# EasyEDA schematic output_schematic_Z.json
TITLE: Sheet_1; REV: 1.0; Date: 2025-10-31; Sheet: 1/1; Drawn By: robdobsn; Company: Your Company
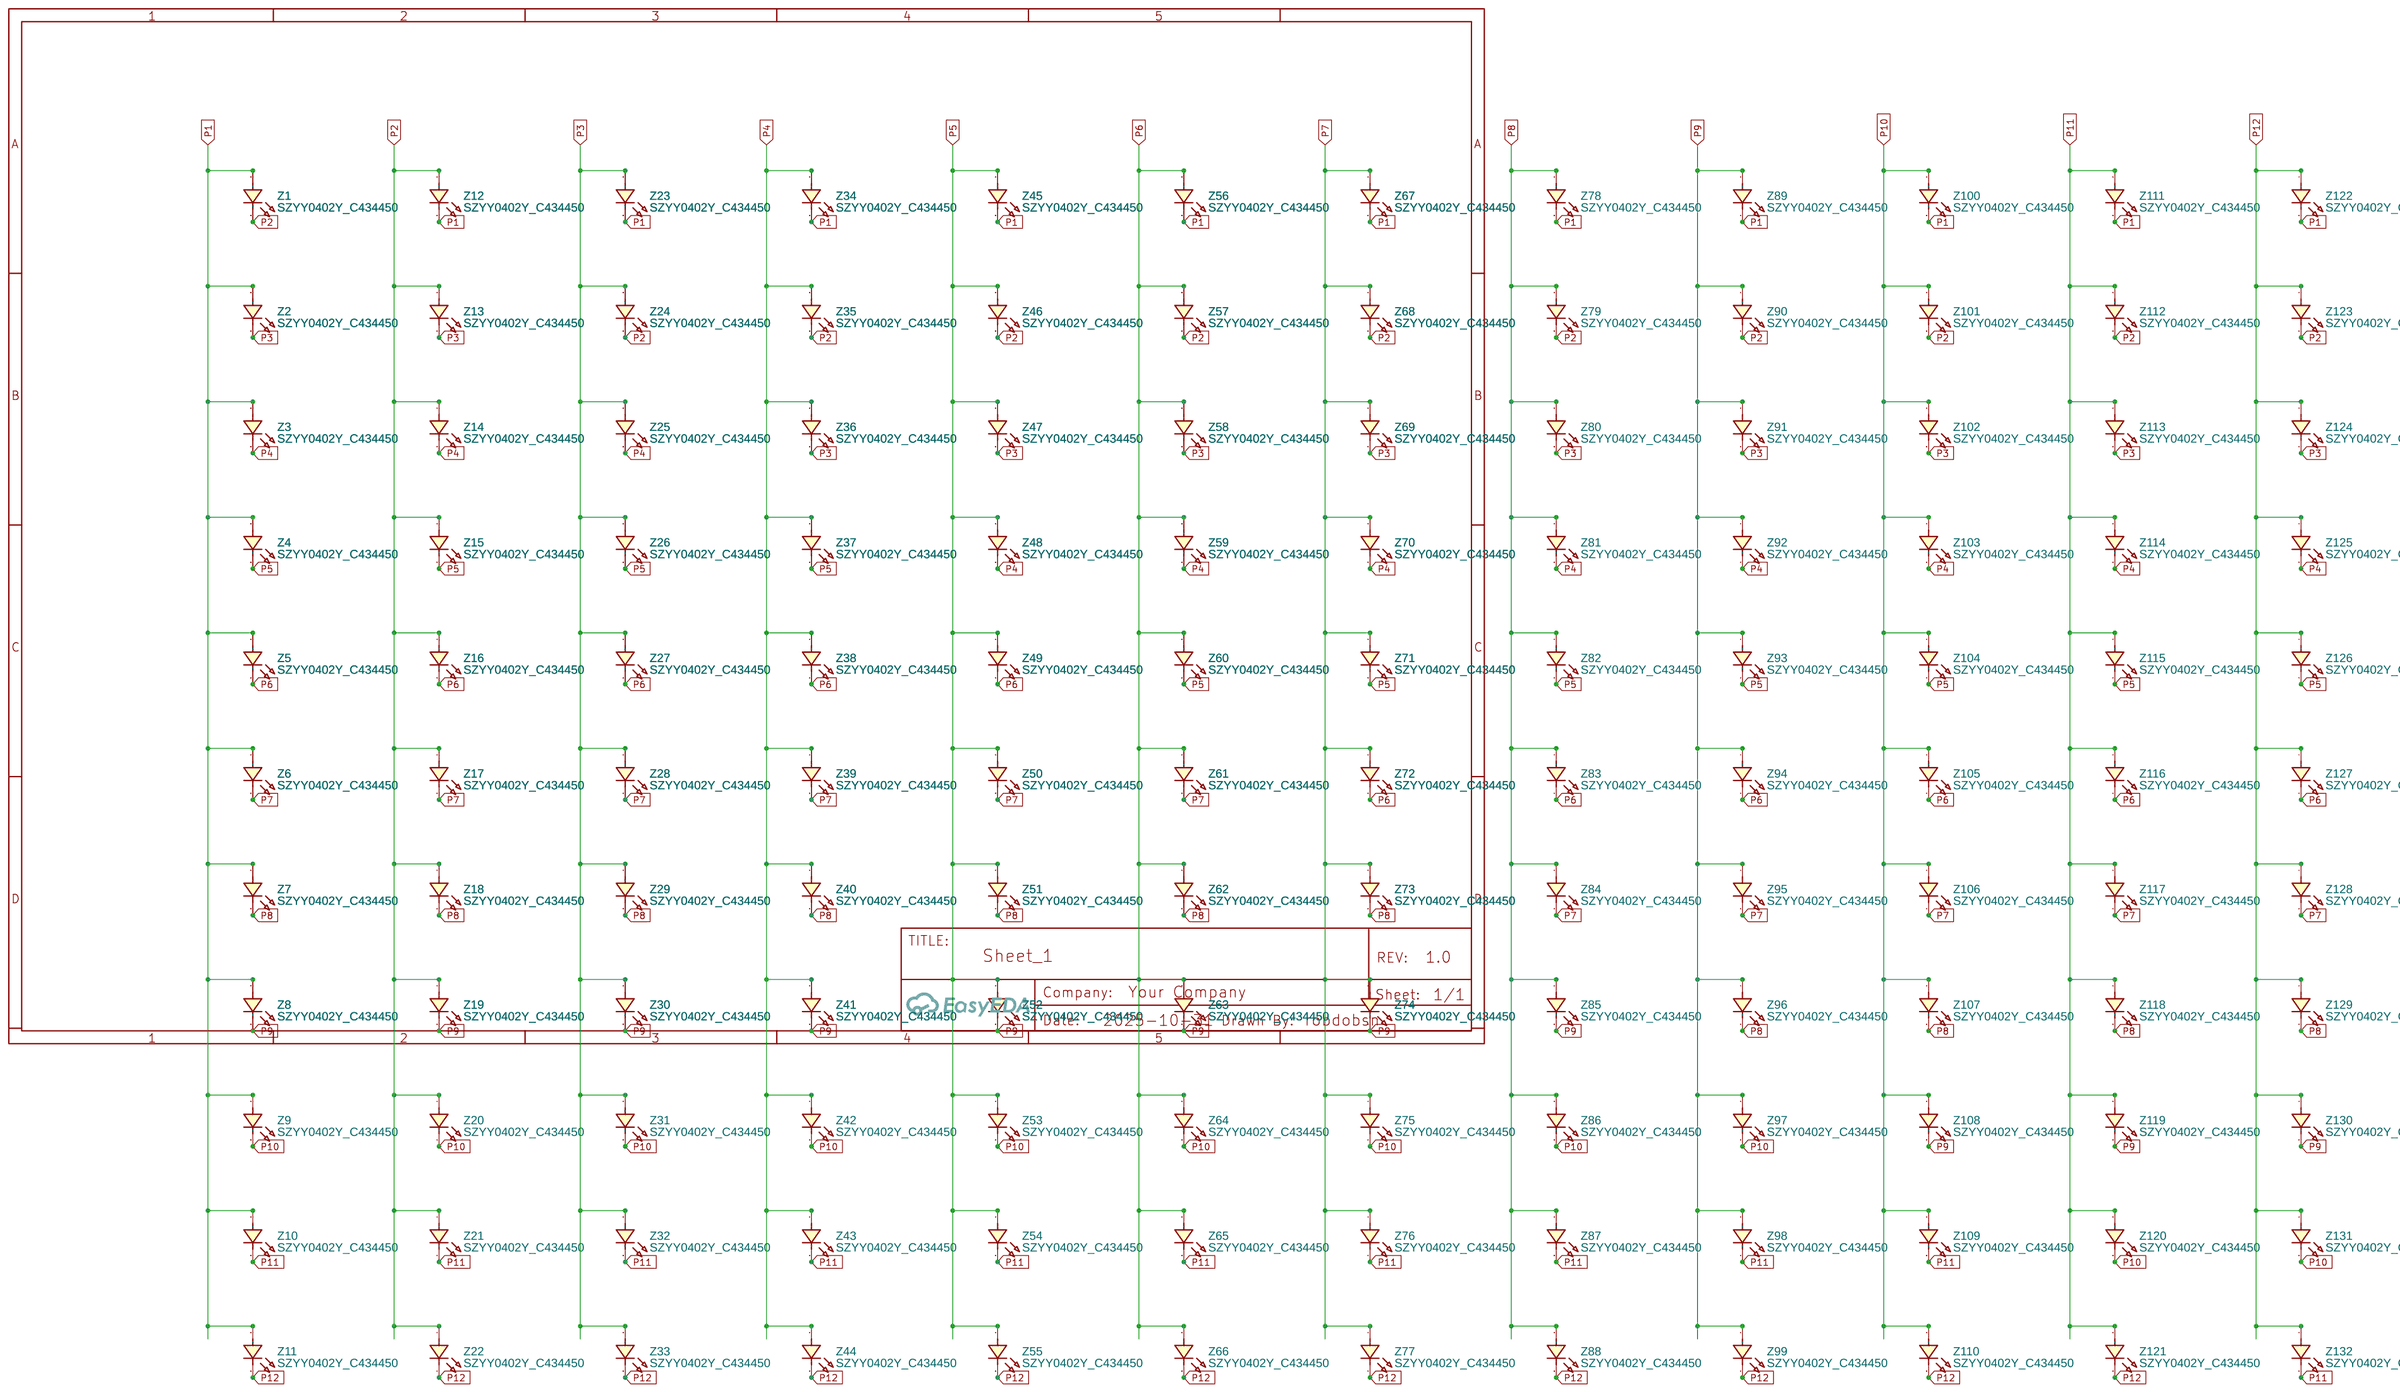
[diagram p0: schematic sheet]

## Parts
Z1  SZYY0402Y_C434450  [LED0402-FD_YELLOW]
Z2  SZYY0402Y_C434450  [LED0402-FD_YELLOW]
Z3  SZYY0402Y_C434450  [LED0402-FD_YELLOW]
Z4  SZYY0402Y_C434450  [LED0402-FD_YELLOW]
Z5  SZYY0402Y_C434450  [LED0402-FD_YELLOW]
Z6  SZYY0402Y_C434450  [LED0402-FD_YELLOW]
Z7  SZYY0402Y_C434450  [LED0402-FD_YELLOW]
Z8  SZYY0402Y_C434450  [LED0402-FD_YELLOW]
Z9  SZYY0402Y_C434450  [LED0402-FD_YELLOW]
Z10  SZYY0402Y_C434450  [LED0402-FD_YELLOW]
Z11  SZYY0402Y_C434450  [LED0402-FD_YELLOW]
Z12  SZYY0402Y_C434450  [LED0402-FD_YELLOW]
Z13  SZYY0402Y_C434450  [LED0402-FD_YELLOW]
Z14  SZYY0402Y_C434450  [LED0402-FD_YELLOW]
Z15  SZYY0402Y_C434450  [LED0402-FD_YELLOW]
Z16  SZYY0402Y_C434450  [LED0402-FD_YELLOW]
Z17  SZYY0402Y_C434450  [LED0402-FD_YELLOW]
Z18  SZYY0402Y_C434450  [LED0402-FD_YELLOW]
Z19  SZYY0402Y_C434450  [LED0402-FD_YELLOW]
Z20  SZYY0402Y_C434450  [LED0402-FD_YELLOW]
Z21  SZYY0402Y_C434450  [LED0402-FD_YELLOW]
Z22  SZYY0402Y_C434450  [LED0402-FD_YELLOW]
Z23  SZYY0402Y_C434450  [LED0402-FD_YELLOW]
Z24  SZYY0402Y_C434450  [LED0402-FD_YELLOW]
Z25  SZYY0402Y_C434450  [LED0402-FD_YELLOW]
Z26  SZYY0402Y_C434450  [LED0402-FD_YELLOW]
Z27  SZYY0402Y_C434450  [LED0402-FD_YELLOW]
Z28  SZYY0402Y_C434450  [LED0402-FD_YELLOW]
Z29  SZYY0402Y_C434450  [LED0402-FD_YELLOW]
Z30  SZYY0402Y_C434450  [LED0402-FD_YELLOW]
Z31  SZYY0402Y_C434450  [LED0402-FD_YELLOW]
Z32  SZYY0402Y_C434450  [LED0402-FD_YELLOW]
Z33  SZYY0402Y_C434450  [LED0402-FD_YELLOW]
Z34  SZYY0402Y_C434450  [LED0402-FD_YELLOW]
Z35  SZYY0402Y_C434450  [LED0402-FD_YELLOW]
Z36  SZYY0402Y_C434450  [LED0402-FD_YELLOW]
Z37  SZYY0402Y_C434450  [LED0402-FD_YELLOW]
Z38  SZYY0402Y_C434450  [LED0402-FD_YELLOW]
Z39  SZYY0402Y_C434450  [LED0402-FD_YELLOW]
Z40  SZYY0402Y_C434450  [LED0402-FD_YELLOW]
Z41  SZYY0402Y_C434450  [LED0402-FD_YELLOW]
Z42  SZYY0402Y_C434450  [LED0402-FD_YELLOW]
Z43  SZYY0402Y_C434450  [LED0402-FD_YELLOW]
Z44  SZYY0402Y_C434450  [LED0402-FD_YELLOW]
Z45  SZYY0402Y_C434450  [LED0402-FD_YELLOW]
Z46  SZYY0402Y_C434450  [LED0402-FD_YELLOW]
Z47  SZYY0402Y_C434450  [LED0402-FD_YELLOW]
Z48  SZYY0402Y_C434450  [LED0402-FD_YELLOW]
Z49  SZYY0402Y_C434450  [LED0402-FD_YELLOW]
Z50  SZYY0402Y_C434450  [LED0402-FD_YELLOW]
Z51  SZYY0402Y_C434450  [LED0402-FD_YELLOW]
Z52  SZYY0402Y_C434450  [LED0402-FD_YELLOW]
Z53  SZYY0402Y_C434450  [LED0402-FD_YELLOW]
Z54  SZYY0402Y_C434450  [LED0402-FD_YELLOW]
Z55  SZYY0402Y_C434450  [LED0402-FD_YELLOW]
Z56  SZYY0402Y_C434450  [LED0402-FD_YELLOW]
Z57  SZYY0402Y_C434450  [LED0402-FD_YELLOW]
Z58  SZYY0402Y_C434450  [LED0402-FD_YELLOW]
Z59  SZYY0402Y_C434450  [LED0402-FD_YELLOW]
Z60  SZYY0402Y_C434450  [LED0402-FD_YELLOW]
Z61  SZYY0402Y_C434450  [LED0402-FD_YELLOW]
Z62  SZYY0402Y_C434450  [LED0402-FD_YELLOW]
Z63  SZYY0402Y_C434450  [LED0402-FD_YELLOW]
Z64  SZYY0402Y_C434450  [LED0402-FD_YELLOW]
Z65  SZYY0402Y_C434450  [LED0402-FD_YELLOW]
Z66  SZYY0402Y_C434450  [LED0402-FD_YELLOW]
Z67  SZYY0402Y_C434450  [LED0402-FD_YELLOW]
Z68  SZYY0402Y_C434450  [LED0402-FD_YELLOW]
Z69  SZYY0402Y_C434450  [LED0402-FD_YELLOW]
Z70  SZYY0402Y_C434450  [LED0402-FD_YELLOW]
Z71  SZYY0402Y_C434450  [LED0402-FD_YELLOW]
Z72  SZYY0402Y_C434450  [LED0402-FD_YELLOW]
Z73  SZYY0402Y_C434450  [LED0402-FD_YELLOW]
Z74  SZYY0402Y_C434450  [LED0402-FD_YELLOW]
Z75  SZYY0402Y_C434450  [LED0402-FD_YELLOW]
Z76  SZYY0402Y_C434450  [LED0402-FD_YELLOW]
Z77  SZYY0402Y_C434450  [LED0402-FD_YELLOW]
Z78  SZYY0402Y_C434450  [LED0402-FD_YELLOW]
Z79  SZYY0402Y_C434450  [LED0402-FD_YELLOW]
Z80  SZYY0402Y_C434450  [LED0402-FD_YELLOW]
Z81  SZYY0402Y_C434450  [LED0402-FD_YELLOW]
Z82  SZYY0402Y_C434450  [LED0402-FD_YELLOW]
Z83  SZYY0402Y_C434450  [LED0402-FD_YELLOW]
Z84  SZYY0402Y_C434450  [LED0402-FD_YELLOW]
Z85  SZYY0402Y_C434450  [LED0402-FD_YELLOW]
Z86  SZYY0402Y_C434450  [LED0402-FD_YELLOW]
Z87  SZYY0402Y_C434450  [LED0402-FD_YELLOW]
Z88  SZYY0402Y_C434450  [LED0402-FD_YELLOW]
Z89  SZYY0402Y_C434450  [LED0402-FD_YELLOW]
Z90  SZYY0402Y_C434450  [LED0402-FD_YELLOW]
Z91  SZYY0402Y_C434450  [LED0402-FD_YELLOW]
Z92  SZYY0402Y_C434450  [LED0402-FD_YELLOW]
Z93  SZYY0402Y_C434450  [LED0402-FD_YELLOW]
Z94  SZYY0402Y_C434450  [LED0402-FD_YELLOW]
Z95  SZYY0402Y_C434450  [LED0402-FD_YELLOW]
Z96  SZYY0402Y_C434450  [LED0402-FD_YELLOW]
Z97  SZYY0402Y_C434450  [LED0402-FD_YELLOW]
Z98  SZYY0402Y_C434450  [LED0402-FD_YELLOW]
Z99  SZYY0402Y_C434450  [LED0402-FD_YELLOW]
Z100  SZYY0402Y_C434450  [LED0402-FD_YELLOW]
Z101  SZYY0402Y_C434450  [LED0402-FD_YELLOW]
Z102  SZYY0402Y_C434450  [LED0402-FD_YELLOW]
Z103  SZYY0402Y_C434450  [LED0402-FD_YELLOW]
Z104  SZYY0402Y_C434450  [LED0402-FD_YELLOW]
Z105  SZYY0402Y_C434450  [LED0402-FD_YELLOW]
Z106  SZYY0402Y_C434450  [LED0402-FD_YELLOW]
Z107  SZYY0402Y_C434450  [LED0402-FD_YELLOW]
Z108  SZYY0402Y_C434450  [LED0402-FD_YELLOW]
Z109  SZYY0402Y_C434450  [LED0402-FD_YELLOW]
Z110  SZYY0402Y_C434450  [LED0402-FD_YELLOW]
Z111  SZYY0402Y_C434450  [LED0402-FD_YELLOW]
Z112  SZYY0402Y_C434450  [LED0402-FD_YELLOW]
Z113  SZYY0402Y_C434450  [LED0402-FD_YELLOW]
Z114  SZYY0402Y_C434450  [LED0402-FD_YELLOW]
Z115  SZYY0402Y_C434450  [LED0402-FD_YELLOW]
Z116  SZYY0402Y_C434450  [LED0402-FD_YELLOW]
Z117  SZYY0402Y_C434450  [LED0402-FD_YELLOW]
Z118  SZYY0402Y_C434450  [LED0402-FD_YELLOW]
Z119  SZYY0402Y_C434450  [LED0402-FD_YELLOW]
Z120  SZYY0402Y_C434450  [LED0402-FD_YELLOW]
Z121  SZYY0402Y_C434450  [LED0402-FD_YELLOW]
Z122  SZYY0402Y_C434450  [LED0402-FD_YELLOW]
Z123  SZYY0402Y_C434450  [LED0402-FD_YELLOW]
Z124  SZYY0402Y_C434450  [LED0402-FD_YELLOW]
Z125  SZYY0402Y_C434450  [LED0402-FD_YELLOW]
Z126  SZYY0402Y_C434450  [LED0402-FD_YELLOW]
Z127  SZYY0402Y_C434450  [LED0402-FD_YELLOW]
Z128  SZYY0402Y_C434450  [LED0402-FD_YELLOW]
Z129  SZYY0402Y_C434450  [LED0402-FD_YELLOW]
Z130  SZYY0402Y_C434450  [LED0402-FD_YELLOW]
Z131  SZYY0402Y_C434450  [LED0402-FD_YELLOW]
Z132  SZYY0402Y_C434450  [LED0402-FD_YELLOW]

## Library data of the parts
Z1-Z132 = SZYY0402Y_C434450: Contributor: lcsc; Supplier: LCSC; Supplier Part: C434450; Manufacturer: yongyu(永裕光电); Manufacturer Part: SZYY0402Y; JLCPCB Part Class: Extended Part

## Nets
P1: Z1.1(A) Z2.1(A) Z3.1(A) Z4.1(A) Z5.1(A) Z6.1(A) Z7.1(A) Z8.1(A) Z9.1(A) Z10.1(A) Z11.1(A) Z12.2(K) Z23.2(K) Z34.2(K) Z45.2(K) Z56.2(K) Z67.2(K) Z78.2(K) Z89.2(K) Z100.2(K) Z111.2(K) Z122.2(K)
P2: Z1.2(K) Z12.1(A) Z13.1(A) Z14.1(A) Z15.1(A) Z16.1(A) Z17.1(A) Z18.1(A) Z19.1(A) Z20.1(A) Z21.1(A) Z22.1(A) Z24.2(K) Z35.2(K) Z46.2(K) Z57.2(K) Z68.2(K) Z79.2(K) Z90.2(K) Z101.2(K) Z112.2(K) Z123.2(K)
P3: Z2.2(K) Z13.2(K) Z23.1(A) Z24.1(A) Z25.1(A) Z26.1(A) Z27.1(A) Z28.1(A) Z29.1(A) Z30.1(A) Z31.1(A) Z32.1(A) Z33.1(A) Z36.2(K) Z47.2(K) Z58.2(K) Z69.2(K) Z80.2(K) Z91.2(K) Z102.2(K) Z113.2(K) Z124.2(K)
P4: Z3.2(K) Z14.2(K) Z25.2(K) Z34.1(A) Z35.1(A) Z36.1(A) Z37.1(A) Z38.1(A) Z39.1(A) Z40.1(A) Z41.1(A) Z42.1(A) Z43.1(A) Z44.1(A) Z48.2(K) Z59.2(K) Z70.2(K) Z81.2(K) Z92.2(K) Z103.2(K) Z114.2(K) Z125.2(K)
P5: Z4.2(K) Z15.2(K) Z26.2(K) Z37.2(K) Z45.1(A) Z46.1(A) Z47.1(A) Z48.1(A) Z49.1(A) Z50.1(A) Z51.1(A) Z52.1(A) Z53.1(A) Z54.1(A) Z55.1(A) Z60.2(K) Z71.2(K) Z82.2(K) Z93.2(K) Z104.2(K) Z115.2(K) Z126.2(K)
P6: Z5.2(K) Z16.2(K) Z27.2(K) Z38.2(K) Z49.2(K) Z56.1(A) Z57.1(A) Z58.1(A) Z59.1(A) Z60.1(A) Z61.1(A) Z62.1(A) Z63.1(A) Z64.1(A) Z65.1(A) Z66.1(A) Z72.2(K) Z83.2(K) Z94.2(K) Z105.2(K) Z116.2(K) Z127.2(K)
P7: Z6.2(K) Z17.2(K) Z28.2(K) Z39.2(K) Z50.2(K) Z61.2(K) Z67.1(A) Z68.1(A) Z69.1(A) Z70.1(A) Z71.1(A) Z72.1(A) Z73.1(A) Z74.1(A) Z75.1(A) Z76.1(A) Z77.1(A) Z84.2(K) Z95.2(K) Z106.2(K) Z117.2(K) Z128.2(K)
P8: Z7.2(K) Z18.2(K) Z29.2(K) Z40.2(K) Z51.2(K) Z62.2(K) Z73.2(K) Z78.1(A) Z79.1(A) Z80.1(A) Z81.1(A) Z82.1(A) Z83.1(A) Z84.1(A) Z85.1(A) Z86.1(A) Z87.1(A) Z88.1(A) Z96.2(K) Z107.2(K) Z118.2(K) Z129.2(K)
P9: Z8.2(K) Z19.2(K) Z30.2(K) Z41.2(K) Z52.2(K) Z63.2(K) Z74.2(K) Z85.2(K) Z89.1(A) Z90.1(A) Z91.1(A) Z92.1(A) Z93.1(A) Z94.1(A) Z95.1(A) Z96.1(A) Z97.1(A) Z98.1(A) Z99.1(A) Z108.2(K) Z119.2(K) Z130.2(K)
P10: Z9.2(K) Z20.2(K) Z31.2(K) Z42.2(K) Z53.2(K) Z64.2(K) Z75.2(K) Z86.2(K) Z97.2(K) Z100.1(A) Z101.1(A) Z102.1(A) Z103.1(A) Z104.1(A) Z105.1(A) Z106.1(A) Z107.1(A) Z108.1(A) Z109.1(A) Z110.1(A) Z120.2(K) Z131.2(K)
P11: Z10.2(K) Z21.2(K) Z32.2(K) Z43.2(K) Z54.2(K) Z65.2(K) Z76.2(K) Z87.2(K) Z98.2(K) Z109.2(K) Z111.1(A) Z112.1(A) Z113.1(A) Z114.1(A) Z115.1(A) Z116.1(A) Z117.1(A) Z118.1(A) Z119.1(A) Z120.1(A) Z121.1(A) Z132.2(K)
P12: Z11.2(K) Z22.2(K) Z33.2(K) Z44.2(K) Z55.2(K) Z66.2(K) Z77.2(K) Z88.2(K) Z99.2(K) Z110.2(K) Z121.2(K) Z122.1(A) Z123.1(A) Z124.1(A) Z125.1(A) Z126.1(A) Z127.1(A) Z128.1(A) Z129.1(A) Z130.1(A) Z131.1(A) Z132.1(A)
